# Altium schematic sheet 驱动模块 原理图.SchDoc
size A4
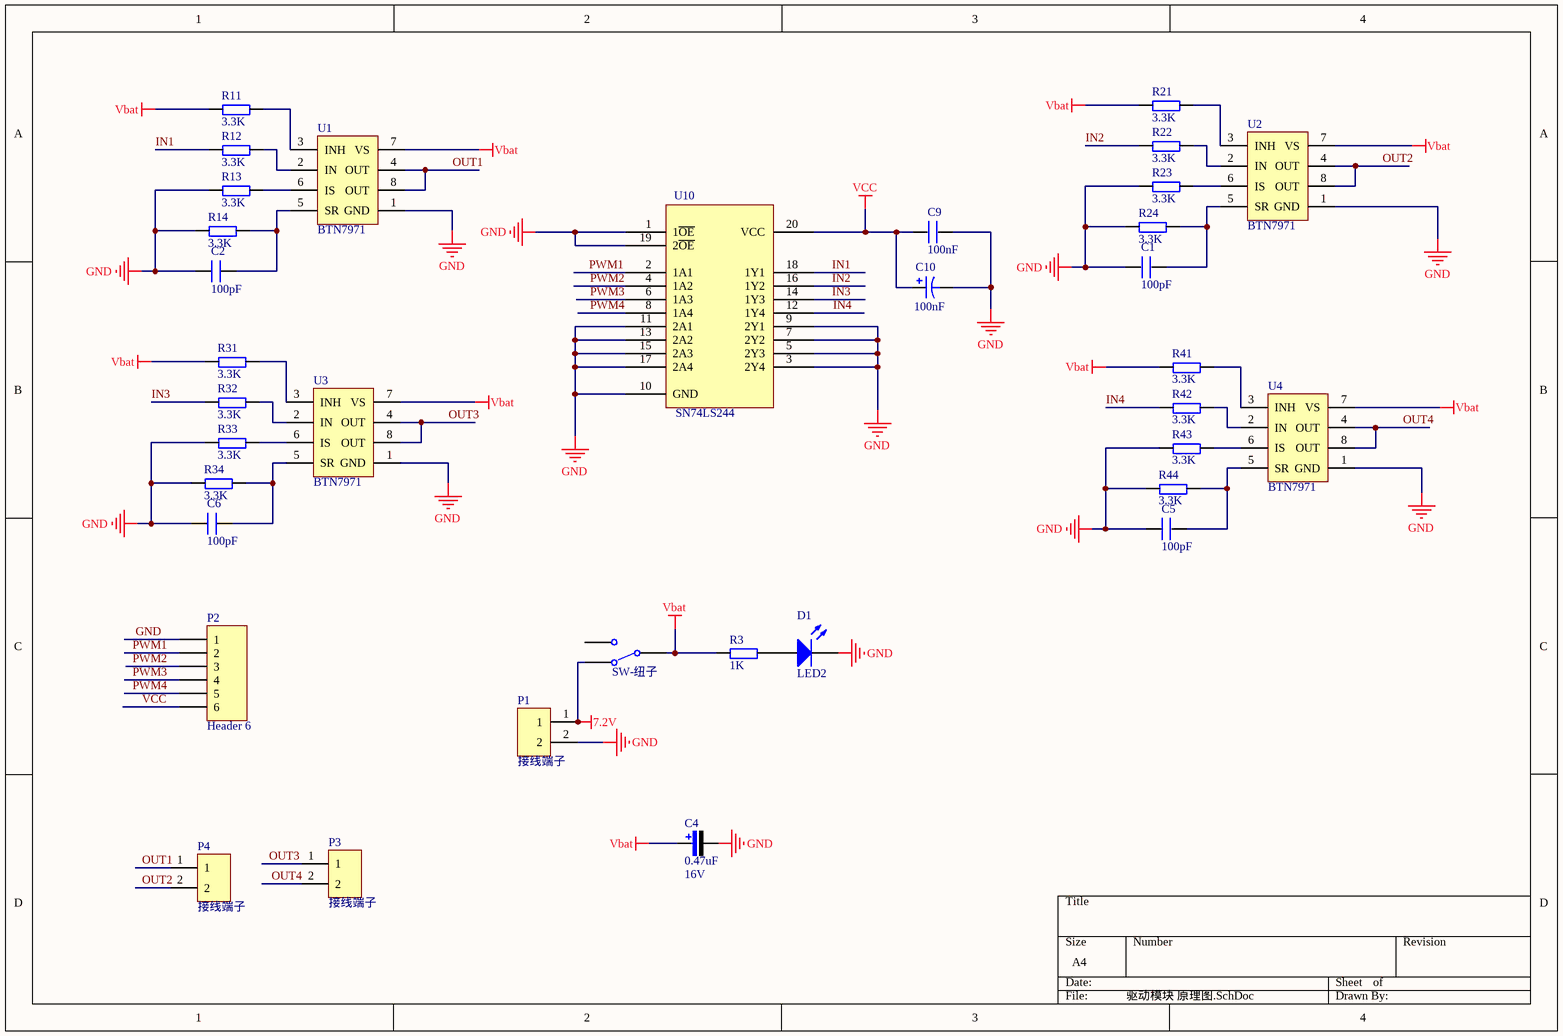
[diagram p0: 驱动模块 原理图.SchDoc]

## Parts
C1  100pF  [0603]
C2  100pF  [0603]
C4  value 0.47uF  Vol: 16V  [CAP-3528]  (hidden comment: Cap Pol)
C5  100pF  [0603]
C6  100pF  [0603]
C9  100nF  [0603]
C10  value 100nF  [CAPC2012L]  (hidden comment: Cap Pol3)
D1  LED2  [DSO-F2/D6.1]
P1  接线端子  [接线端子]
P2  Header 6  [HDR1X6]
P3  接线端子  [接线端子]
P4  接线端子  [接线端子]
R3  1K  [0603]
R11  3.3K  [0603]
R12  3.3K  [0603]
R13  3.3K  [0603]
R14  3.3K  [0603]
R21  3.3K  [0603]
R22  3.3K  [0603]
R23  3.3K  [0603]
R24  3.3K  [0603]
R31  3.3K  [0603]
R32  3.3K  [0603]
R33  3.3K  [0603]
R34  3.3K  [0603]
R41  3.3K  [0603]
R42  3.3K  [0603]
R43  3.3K  [0603]
R44  3.3K  [0603]
SW1  SW-纽子  [SW-纽子]
U1  BTN7971  [BTN7971]
U2  BTN7971  [BTN7971]
U3  BTN7971  [BTN7971]
U4  BTN7971  [BTN7971]
U10  SN74LS244  [SN74LS244]

## Nets
7.2V: P1.1 SW1.1(NO)
GND: C1.1 C2.1 C4.2 C5.1 C6.1 C9.2 C10.2 D1.2(K) P1.2 P2.1 R13.1 R14.1 R23.1 R24.1 R33.1 R34.1 R43.1 R44.1 U1.1(GND) U2.1(GND) U3.1(GND) U4.1(GND) U10.1(1~{OE}) U10.3(2Y4) U10.5(2Y3) U10.7(2Y2) U10.9(2Y1) U10.10(GND) U10.11(2A1) U10.13(2A2) U10.15(2A3) U10.17(2A4) U10.19(2~{OE})
Vbat: C4.1 R3.1 R11.1 R21.1 R31.1 R41.1 SW1.2(COMMON) U1.7(VS) U2.7(VS) U3.7(VS) U4.7(VS)
VCC: C9.1 C10.1 P2.6 U10.20(VCC)
IN1: R12.1 U10.18(1Y1)
IN2: R22.1 U10.16(1Y2)
IN3: R32.1 U10.14(1Y3)
IN4: R42.1 U10.12(1Y4)
OUT1: P4.1 U1.4(OUT) U1.8(OUT)
OUT2: P4.2 U2.4(OUT) U2.8(OUT)
OUT3: P3.1 U3.4(OUT) U3.8(OUT)
OUT4: P3.2 U4.4(OUT) U4.8(OUT)
PWM1: P2.2 U10.2(1A1)
PWM2: P2.3 U10.4(1A2)
PWM3: P2.4 U10.6(1A3)
PWM4: P2.5 U10.8(1A4)
NetC1_2: C1.2 R24.2 U2.5(SR)
NetC2_2: C2.2 R14.2 U1.5(SR)
NetC5_2: C5.2 R44.2 U4.5(SR)
NetC6_2: C6.2 R34.2 U3.5(SR)
NetD1_1: D1.1(A) R3.2
NetR11_2: R11.2 U1.3(INH)
NetR12_2: R12.2 U1.2(IN)
NetR13_2: R13.2 U1.6(IS)
NetR21_2: R21.2 U2.3(INH)
NetR22_2: R22.2 U2.2(IN)
NetR23_2: R23.2 U2.6(IS)
NetR31_2: R31.2 U3.3(INH)
NetR32_2: R32.2 U3.2(IN)
NetR33_2: R33.2 U3.6(IS)
NetR41_2: R41.2 U4.3(INH)
NetR42_2: R42.2 U4.2(IN)
NetR43_2: R43.2 U4.6(IS)

Not connected (* = marked no-connect by the designer): SW1 3(OFF)

## Library data of the parts
C1 C2 C5 C6 C9 = Cap
C4 = Cap Pol: 极性电解电容; Published: 8-Jun-2000; LatestRevisionDate: 17-Jul-2002; LatestRevisionNote: Re-released for DXP Platform.; PackageReference: RB7.6-15; Publisher: Altium Limited
C10 = Cap Pol3: Polarized Capacitor (Surface Mount); Published: 8-Jun-2000; LatestRevisionDate: 29-May-2009; LatestRevisionNote: IPC-7351 Footprint Added.; PackageReference: C0805; Publisher: Altium Limited; PackageDescription: Chip Capacitor
D1 = LED2: Typical RED, GREEN, YELLOW, AMBER GaAs LED; Published: 8-Jun-2000; LatestRevisionDate: 17-Jul-2002; LatestRevisionNote: Re-released for DXP Platform.; PackageVersion: Feb-2002; PackageReference: 3.2X1.6X1.1; Publisher: Altium Limited
P2 = Header 6: Header, 6-Pin; LatestRevisionDate: 17-Jul-2002; LatestRevisionNote: Re-released for DXP Platform.; Publisher: Altium Limited
R3 R11-R14 R21-R24 R31-R34 R41-R44 = R